# Altium schematic sheet RF Transceiver Module (RF).SchDoc
size A4; SheetNumber: 8; SheetTotal: 10
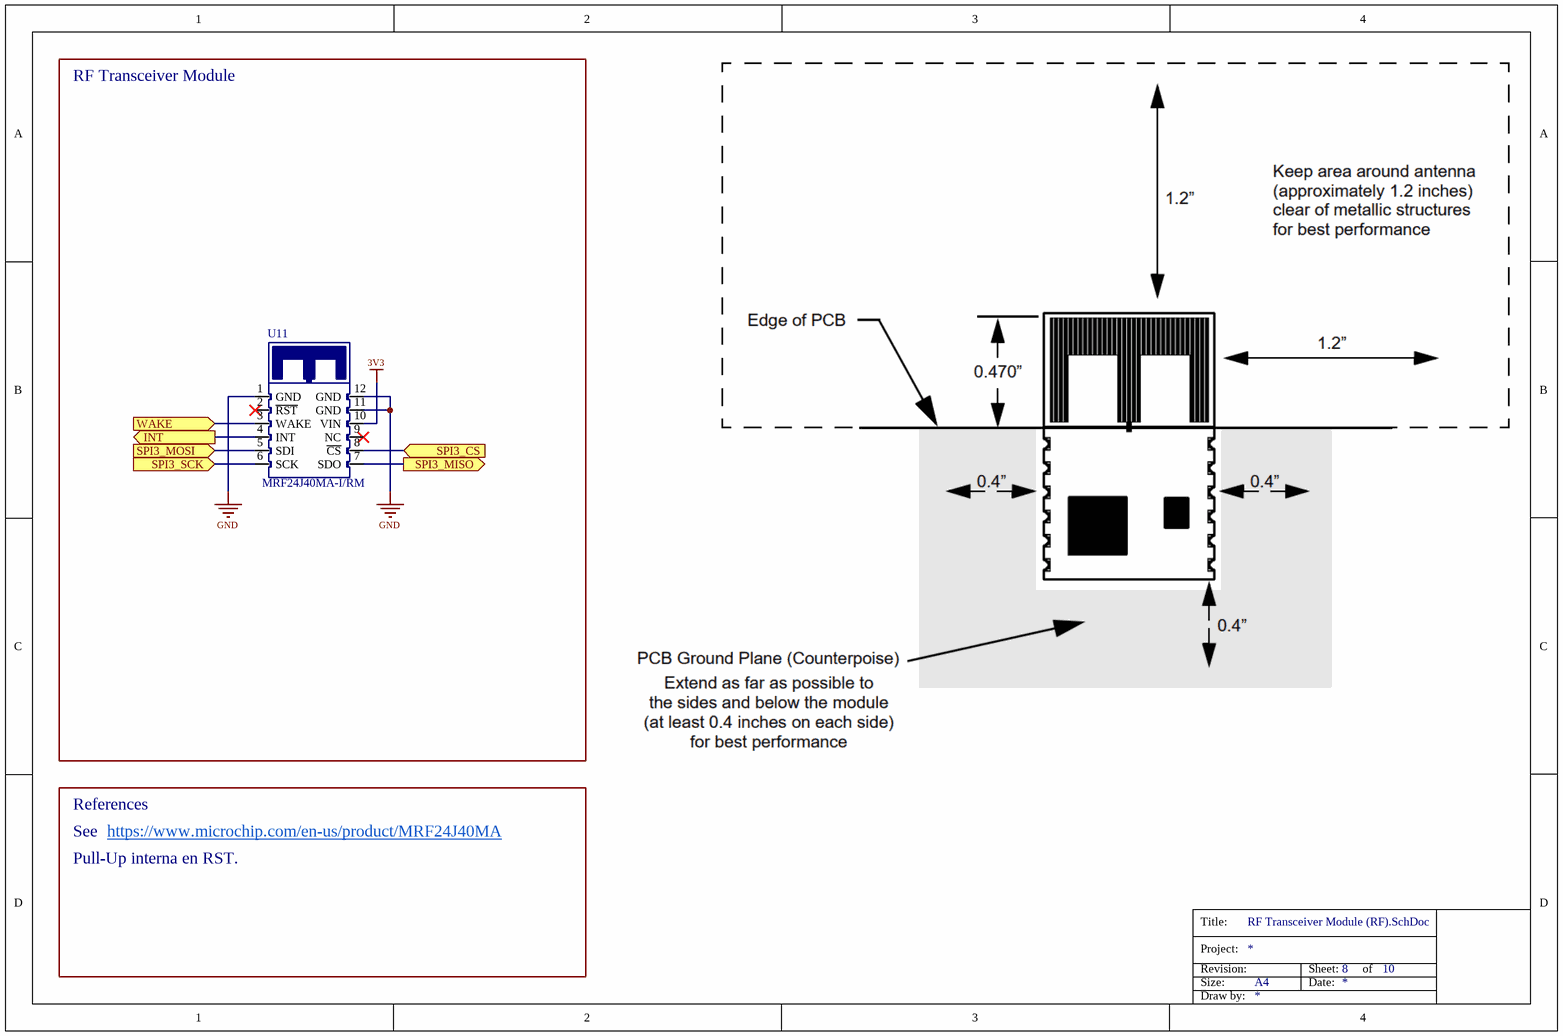
[diagram p0: RF Transceiver Module (RF).SchDoc]

## Parts
U11  Part Number: MRF24J40MA-I/RM  [PKG1100X700-12N]  (hidden comment: RF Transceiver Module)

## Blocks framed on the sheet
RF Transceiver Module: U11

## Ports
INT (out, see Main[2C], Microcontroller (MCU)[2A]), SPI3_CS (in, see Main[2C], Microcontroller (MCU)[2B]), SPI3_MISO (out, see Main[2C], Microcontroller (MCU)[2C]), SPI3_MOSI (in, see Main[2C], Microcontroller (MCU)[2C]), SPI3_SCK (in, see Main[2C], Microcontroller (MCU)[2C]), WAKE (in, see Main[2C], Microcontroller (MCU)[2C])

## Nets
3V3: U11.10(VIN)
GND: U11.1(GND) U11.11(GND) U11.12(GND)
INT: U11.4(INT) ; port INT
SPI3_CS: U11.8(~{CS}) ; port SPI3_CS
SPI3_MISO: U11.7(SDO) ; port SPI3_MISO
SPI3_MOSI: U11.5(SDI) ; port SPI3_MOSI
SPI3_SCK: U11.6(SCK) ; port SPI3_SCK
WAKE: U11.3(WAKE) ; port WAKE

Not connected (* = marked no-connect by the designer): U11 2(~{RST})* 9(NC)*

## Notes on the sheet
- References
- See
- https://www.microchip.com/en-us/product/MRF24J40MA
- Pull-Up interna en RST.
- Title:
- Project:
- Revision:
- Size:
- A4
- Sheet:
- Date:
- of
- Draw by:

## Library data of the parts
U11 = U-MRF24J40MA: Zigbee Modules - 802.15.4 2.4GHz IEEE 802.15.4 Transceiver Module; Manufacturer: Microchip; Mounting Type: SMT; Mouser Part #: 579-MRF24J40MA-I/RM; Digikey Part #: MRF24J40MA-I/RM-ND; JLCPCB Part #: C641083